# EAGLE design penny (EAGLE 7.1.0)
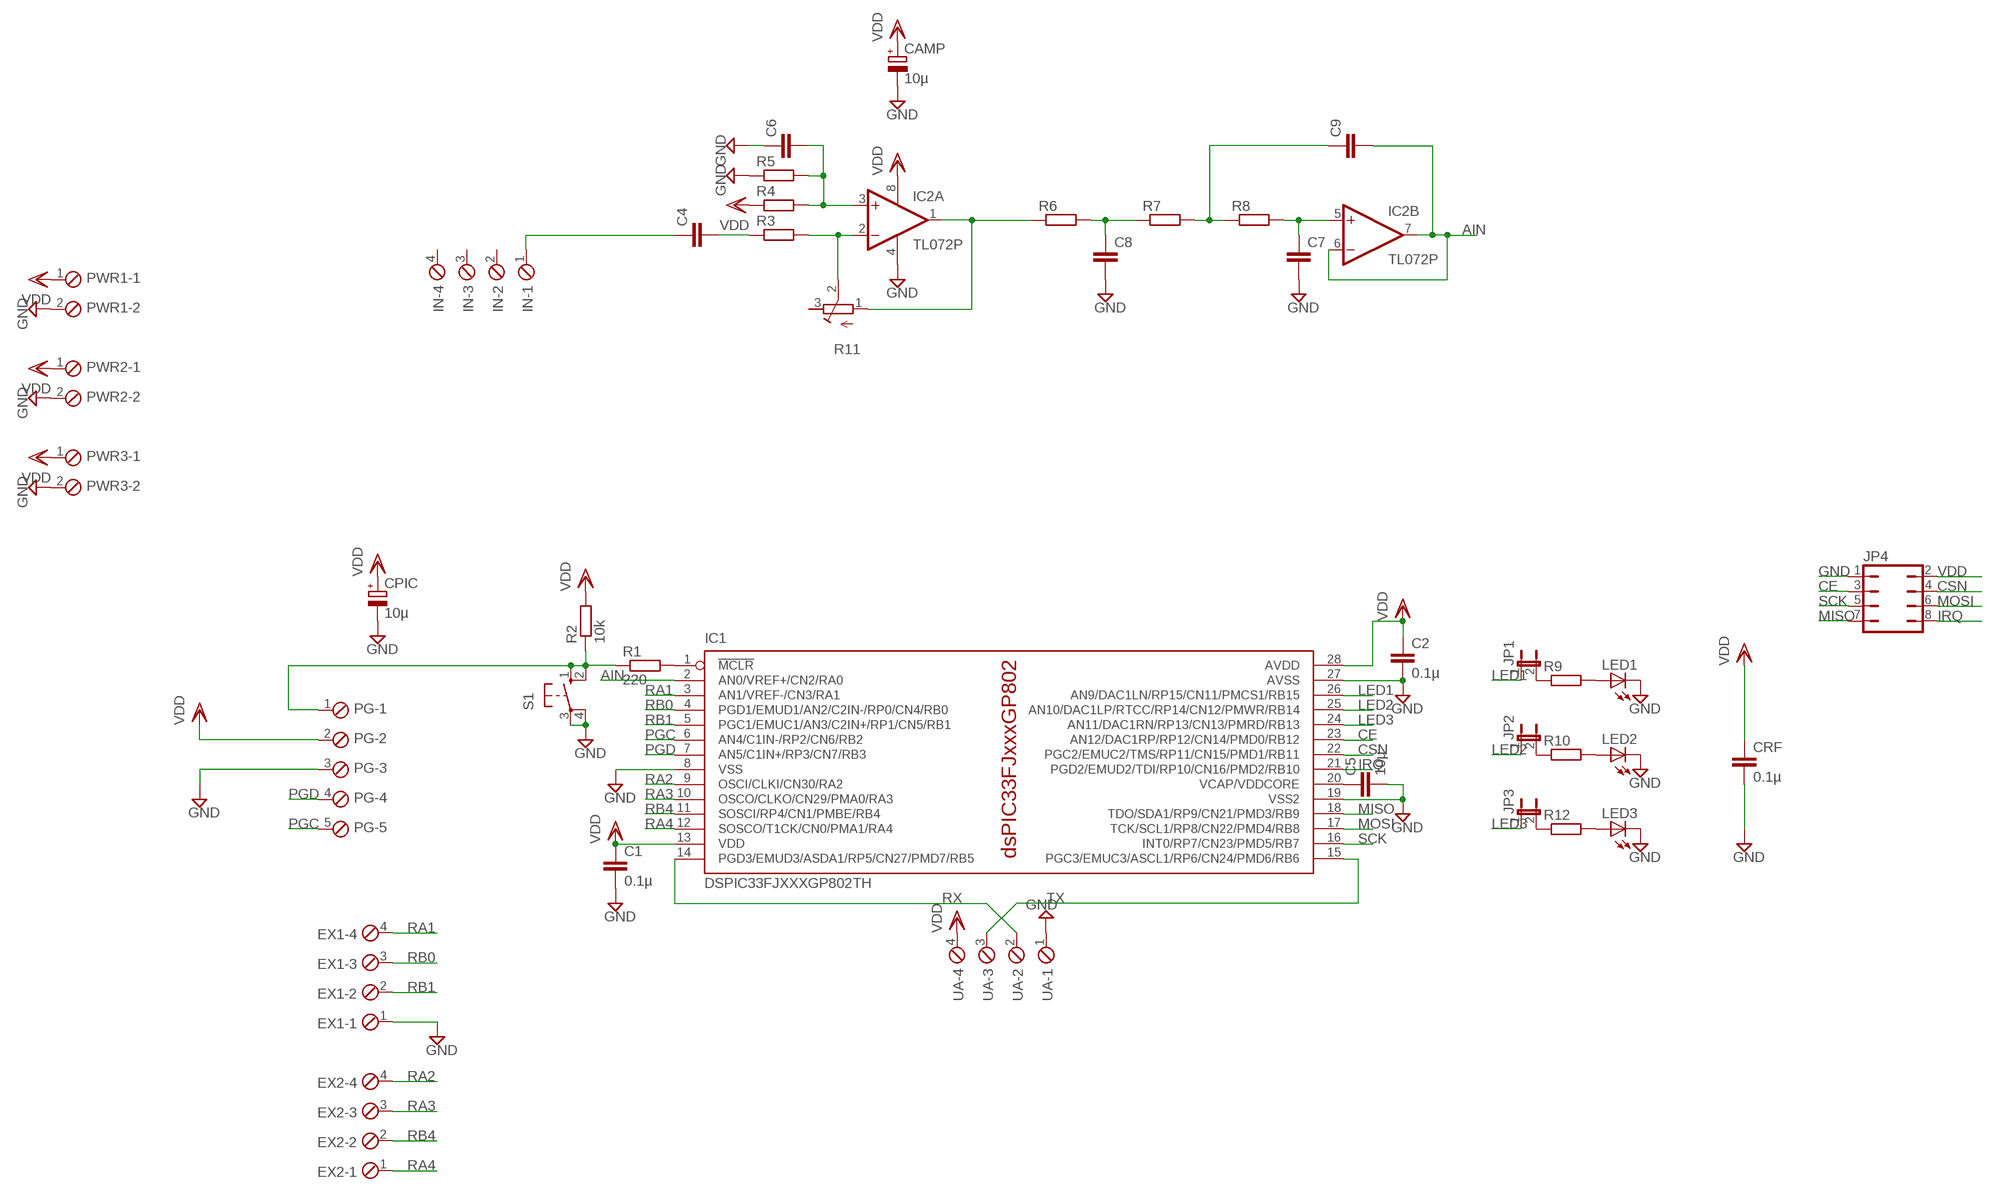
[diagram p0: schematic, sheet 1]

## Parts
C1  0.1µ  C-EU025-024X044  [C025-024X044]
C2  0.1µ  C-EU025-024X044  [C025-024X044]
C4  C-EU025-024X044  [C025-024X044]
C5  10µ  C-EU025-024X044  [C025-024X044]
C6  C-EU025-024X044  [C025-024X044]
C7  C-EU025-024X044  [C025-024X044]
C8  C-EU025-024X044  [C025-024X044]
C9  C-EU025-024X044  [C025-024X044]
CAMP  10µ  CPOL-EUE2.5-5  [E2,5-5]
CPIC  10µ  CPOL-EUE2.5-5  [E2,5-5]
CRF  0.1µ  C-EU025-024X044  [C025-024X044]
EX1  MPT4  [4POL254]
EX2  MPT4  [4POL254]
IC1  DSPIC33FJXXXGP802TH  [DIL28-3]
IC2  TL072P  [DIL08]
IN  MPT4  [4POL254]
JP1  JP1E  [JP1]
JP2  JP1E  [JP1]
JP3  JP1E  [JP1]
JP4  JP4Q  [JP4Q]
LED1  LED3MM  [LED3MM]
LED2  LED3MM  [LED3MM]
LED3  LED3MM  [LED3MM]
PG  MPT5  [5POL254]
PWR1  MPT2  [2POL254]
PWR2  MPT2  [2POL254]
PWR3  MPT2  [2POL254]
R1  220  R-EU_0207/10  [0207/10]
R2  10k  R-EU_0207/10  [0207/10]
R3  R-EU_0207/10  [0207/10]
R4  R-EU_0207/10  [0207/10]
R5  R-EU_0207/10  [0207/10]
R6  R-EU_0207/10  [0207/10]
R7  R-EU_0207/10  [0207/10]
R8  R-EU_0207/10  [0207/10]
R9  R-EU_0207/10  [0207/10]
R10  R-EU_0207/10  [0207/10]
R11  R-TRIMM3339P  [RTRIM3339P]
R12  R-EU_0207/10  [0207/10]
S1  10-XX  [B3F-10XX]
UA  MPT4  [4POL254]

## Nets
AIN: C9.2 IC1.2(AN0/VREF+/CN2/RA0) IC2.6(B:-IN) IC2.7(B:OUT)
CE: IC1.23(AN12/DAC1RP/RP12/CN14/PMD0/RB12) JP4.3
CSN: IC1.22(PGC2/EMUC2/TMS/RP11/CN15/PMD1/RB11) JP4.4
GND: C1.2 C2.2 C5.2 C6.1 C7.2 C8.2 CAMP.- CPIC.- CRF.2 EX1.1 IC1.8(VSS) IC1.19(VSS2) IC1.27(AVSS) IC2.4(P:V-) JP4.1 LED1.K(C) LED2.K(C) LED3.K(C) PG.3 PWR1.2 PWR2.2 PWR3.2 R5.1 S1.3(P) S1.4(P1) UA.1
IRQ: IC1.21(PGD2/EMUD2/TDI/RP10/CN16/PMD2/RB10) JP4.8
LED1: IC1.26(AN9/DAC1LN/RP15/CN11/PMCS1/RB15) JP1.1
LED2: IC1.25(AN10/DAC1LP/RTCC/RP14/CN12/PMWR/RB14) JP2.1
LED3: IC1.24(AN11/DAC1RN/RP13/CN13/PMRD/RB13) JP3.1
MISO: IC1.18(TDO/SDA1/RP9/CN21/PMD3/RB9) JP4.7
MOSI: IC1.17(TCK/SCL1/RP8/CN22/PMD4/RB8) JP4.6
N$1: IC1.1(!MCLR) R1.2
N$2: PG.1 R1.1 R2.1 S1.1(S) S1.2(S1)
N$3: C6.2 IC2.3(A:+IN) R4.2 R5.2
N$4: IC2.2(A:-IN) R3.2 R11.2(S)
N$5: C4.2 R3.1
N$6: IC2.1(A:OUT) R6.1 R11.1(A)
N$7: C4.1 IN.1
N$8: C8.1 R6.2 R7.1
N$9: C5.1 IC1.20(VCAP/VDDCORE)
N$10: C9.1 R7.2 R8.1
N$11: C7.1 IC2.5(B:+IN) R8.2
N$12: JP1.2 R9.1
N$13: LED1.A R9.2
N$14: JP2.2 R10.1
N$15: LED2.A R10.2
N$16: LED3.A R12.2
N$17: JP3.2 R12.1
PGC: IC1.6(AN4/C1IN-/RP2/CN6/RB2) PG.5
PGD: IC1.7(AN5/C1IN+/RP3/CN7/RB3) PG.4
RA1: EX1.4 IC1.3(AN1/VREF-/CN3/RA1)
RA2: EX2.4 IC1.9(OSCI/CLKI/CN30/RA2)
RA3: EX2.3 IC1.10(OSCO/CLKO/CN29/PMA0/RA3)
RA4: EX2.1 IC1.12(SOSCO/T1CK/CN0/PMA1/RA4)
RB0: EX1.3 IC1.4(PGD1/EMUD1/AN2/C2IN-/RP0/CN4/RB0)
RB1: EX1.2 IC1.5(PGC1/EMUC1/AN3/C2IN+/RP1/CN5/RB1)
RB4: EX2.2 IC1.11(SOSCI/RP4/CN1/PMBE/RB4)
RX: IC1.14(PGD3/EMUD3/ASDA1/RP5/CN27/PMD7/RB5) UA.2
SCK: IC1.16(INT0/RP7/CN23/PMD5/RB7) JP4.5
TX: IC1.15(PGC3/EMUC3/ASCL1/RP6/CN24/PMD6/RB6) UA.3
VDD: C1.1 C2.1 CAMP.+ CPIC.+ CRF.1 IC1.13(VDD) IC1.28(AVDD) IC2.8(P:V+) JP4.2 PG.2 PWR1.1 PWR2.1 PWR3.1 R2.2 R4.1 UA.4
Unconnected: IN.2 IN.3 IN.4 R11.3(E)

## Library data of the parts
C1 C2 C4-C9 CRF = rcl:C-EU: CAPACITOR, European symbol
CAMP CPIC = rcl:CPOL-EU: POLARIZED CAPACITOR, European symbol
EX1 EX2 IN UA = con-phoenix-254:MPT4: PHOENIX CONNECTOR; OC_FARNELL: unknown; OC_NEWARK: unknown
IC1 = microchip-dspic33:DSPIC33FJXXXGP802: High-Performance, 16-bit Digital Signal Controllers - dsPIC33FJ64GP802 & dsPIC33FJ128GP802 Source: http://ww1.microchip.com/downloads/en/DeviceDoc/70292B.pdf Operating Range: . Up to 40 MIPS operation (at 3.0-3.6V): - Industrial temperature range (-40°C to +85°C) - Extended temperature range (-40°C to +125°C) High-Performance DSC CPU: . Modified Harvard architecture . C compiler optimized instruction set . 16-bit wide data path . 24-bit wide instructions . Linear program memory addressing up to 4M instruction words . Linear data memory addressing up to 64 Kbytes . 83 base instructions: mostly 1 word/1 cycle . Two 40-bit accumulators with rounding and saturation options . Flexible and powerful addressing modes: - Indirect - Modulo - Bit-Reversed . Software stack . 16 x 16 fractional/integer multiply operations . 32/16 and 16/16 divide operations . Single-cycle multiply and accumulate: - Accumulator write back for DSP operations - Dual data fetch . Up to ±16-bit shifts for up to 40-bit data On-Chip Flash and SRAM: . Flash program memory . Data SRAM . Boot, Secure, and General Security for program Flash Direct Memory Access (DMA): . 8-channel hardware DMA . Up to 2 Kbytes dual ported DMA buffer area (DMA RAM) to store data transferred via DMA: - Allows data transfer between RAM and a peripheral while CPU is executing code (no cycle stealing) . Most peripherals support DMA Timers/Capture/Compare/PWM: . Timer/Counters, up to five 16-bit timers: - Can pair up to make two 32-bit timers - One timer runs as a Real-Time Clock with an external 32.768 kHz oscillator - Programmable prescaler . Input Capture (up to four channels): - Capture on up, down or both edges - 16-bit capture input functions - 4-deep FIFO on each capture . Output Compare (up to four channels): - Single or Dual 16-bit Compare mode - 16-bit Glitchless PWM mode . Hardware Real-Time Clock/Calendar (RTCC): - Provides clock, calendar, and alarm functions Interrupt Controller: . 5-cycle latency . 118 interrupt vectors . Up to 49 available interrupt sources . Up to three external interrupts . Seven programmable priority levels . Five processor exceptions Digital I/O: . Peripheral pin Select functionality . Up to 35 programmable digital I/O pins . Wake-up/Interrupt-on-Change for up to 21 pins . Output pins can drive from 3.0V to 3.6V . Up to 5V output with open drain configuration . All digital input pins are 5V tolerant . 4 mA sink on all I/O pins System Management: . Flexible clock options: - External, crystal, resonator, internal RC - Fully integrated Phase-Locked Loop (PLL) - Extremely low jitter PLL . Power-up Timer . Oscillator Start-up Timer/Stabilizer . Watchdog Timer with its own RC oscillator . Fail-Safe Clock Monitor . Reset by multiple sources Power Management: . On-chip 2.5V voltage regulator . Switch between clock sources in real time . Idle, Sleep, and Doze modes with fast wake-up Analog-to-Digital Converters (ADCs): . 10-bit, 1.1 Msps or 12-bit, 500 Ksps conversion: - Two and four simultaneous samples (10-bit ADC) - Up to 13 input channels with auto-scanning - Conversion start can be manual or synchronized with one of four trigger sources - Conversion possible in Sleep mode - ±2 LSb max integral nonlinearity - ±1 LSb max differential nonlinearity Audio Digital-to-Analog Converter (DAC): . 16-bit Dual Channel DAC module . 100 Ksps maximum sampling rate . Second-Order Digital Delta-Sigma Modulator Data Converter Interface (DCI) module: . Codec interface . Supports I2S and AC.97 protocols . Up to 16-bit data words, up to 16 words per frame . 4-word deep TX and RX buffers Comparator Module: . Two analog comparators with programmable input/output configuration CMOS Flash Technology: . Low-power, high-speed Flash technology . Fully static design . 3.3V (±10%) operating voltage . Industrial and Extended temperature . Low power consumption Communication Modules: . 4-wire SPI (up to two modules): - Framing supports I/O interface to simple codecs - Supports 8-bit and 16-bit data - Supports all serial clock formats and sampling modes . I2C?: - Full Multi-Master Slave mode support - 7-bit and 10-bit addressing - Bus collision detection and arbitration - Integrated signal conditioning - Slave address masking . UART (up to two modules): - Interrupt on address bit detect - Interrupt on UART error - Wake-up on Start bit from Sleep mode - 4-character TX and RX FIFO buffers - LIN bus support - IrDA® encoding and decoding in hardware - High-Speed Baud mode - Hardware Flow Control with CTS and RTS . Enhanced CAN (ECAN. module) 2.0B active: - Up to eight transmit and up to 32 receive buffers - 16 receive filters and three masks - Loopback, Listen Only and Listen All - Messages modes for diagnostics and bus monitoring - Wake-up on CAN message - Automatic processing of Remote Transmission Requests - FIFO mode using DMA - DeviceNet. addressing support . Parallel Master Slave Port (PMP/EPSP): - Supports 8-bit or 16-bit data - Supports 16 address lines . Programmable Cyclic Redundancy Check (CRC): - Programmable bit length for the CRC generator polynomial (up to 16-bit length) - 8-deep, 16-bit or 16-deep, 8-bit FIFO for data input
IC2 = linear:TL072: OP AMP
JP1-JP3 = jumper:JP1E: JUMPER
JP4 = jumper:JP4Q: JUMPER
LED1-LED3 = led:LED: LED OSRAM: - CHIPLED LG R971, LG N971, LY N971, LG Q971, LY Q971, LO R971, LY R971 LH N974, LH R974 LS Q976, LO Q976, LY Q976 LO Q996 - Hyper CHIPLED LW Q18S LB Q993, LB Q99A, LB R99A - SideLED LS A670, LO A670, LY A670, LG A670, LP A670 LB A673, LV A673, LT A673, LW A673 LH A674 LY A675 LS A676, LA A676, LO A676, LY A676, LW A676 LS A679, LY A679, LG A679 - Hyper Micro SIDELED® LS Y876, LA Y876, LO Y876, LY Y876 LT Y87S - SmartLED LW L88C, LW L88S LB L89C, LB L89S, LG L890 LS L89K, LO L89K, LY L89K LS L896, LA L896, LO L896, LY L896 - TOPLED LS T670, LO T670, LY T670, LG T670, LP T670 LSG T670, LSP T670, LSY T670, LOP T670, LYG T670 LG T671, LOG T671, LSG T671 LB T673, LV T673, LT T673, LW T673 LH T674 LS T676, LA T676, LO T676, LY T676, LB T676, LH T676, LSB T676, LW T676 LB T67C, LV T67C, LT T67C, LS T67K, LO T67K, LY T67K, LW E67C LS E67B, LA E67B, LO E67B, LY E67B, LB E67C, LV E67C, LT E67C LW T67C LS T679, LY T679, LG T679 LS T770, LO T770, LY T770, LG T770, LP T770 LB T773, LV T773, LT T773, LW T773 LH T774 LS E675, LA E675, LY E675, LS T675 LS T776, LA T776, LO T776, LY T776, LB T776 LHGB T686 LT T68C, LB T68C - Hyper Mini TOPLED® LB M676 - Mini TOPLED Santana® LG M470 LS M47K, LO M47K, LY M47K Source: http://www.osram.convergy.de LUXEON: - LUMILED® LXK2-PW12-R00, LXK2-PW12-S00, LXK2-PW14-U00, LXK2-PW14-V00 LXK2-PM12-R00, LXK2-PM12-S00, LXK2-PM14-U00 LXK2-PE12-Q00, LXK2-PE12-R00, LXK2-PE12-S00, LXK2-PE14-T00, LXK2-PE14-U00 LXK2-PB12-K00, LXK2-PB12-L00, LXK2-PB12-M00, LXK2-PB14-N00, LXK2-PB14-P00, LXK2-PB14-Q00 LXK2-PR12-L00, LXK2-PR12-M00, LXK2-PR14-Q00, LXK2-PR14-R00 LXK2-PD12-Q00, LXK2-PD12-R00, LXK2-PD12-S00 LXK2-PH12-R00, LXK2-PH12-S00 LXK2-PL12-P00, LXK2-PL12-Q00, LXK2-PL12-R00 Source: www.luxeon.com KINGBRIGHT: KA-3528ASYC Source: www.kingbright.com
PG = con-phoenix-254:MPT5: PHOENIX CONNECTOR; OC_FARNELL: unknown; OC_NEWARK: unknown
PWR1-PWR3 = con-phoenix-254:MPT2: PHOENIX CONNECTOR; OC_FARNELL: unknown; OC_NEWARK: unknown
R1-R10 R12 = rcl:R-EU_: RESISTOR, European symbol
R11 = rcl:R-TRIMM: Trimm resistor
S1 = switch-omron:10-XX: OMRON SWITCH; MPN: B3F-1000; OC_FARNELL: 176432; OC_NEWARK: 36M3542

## Board
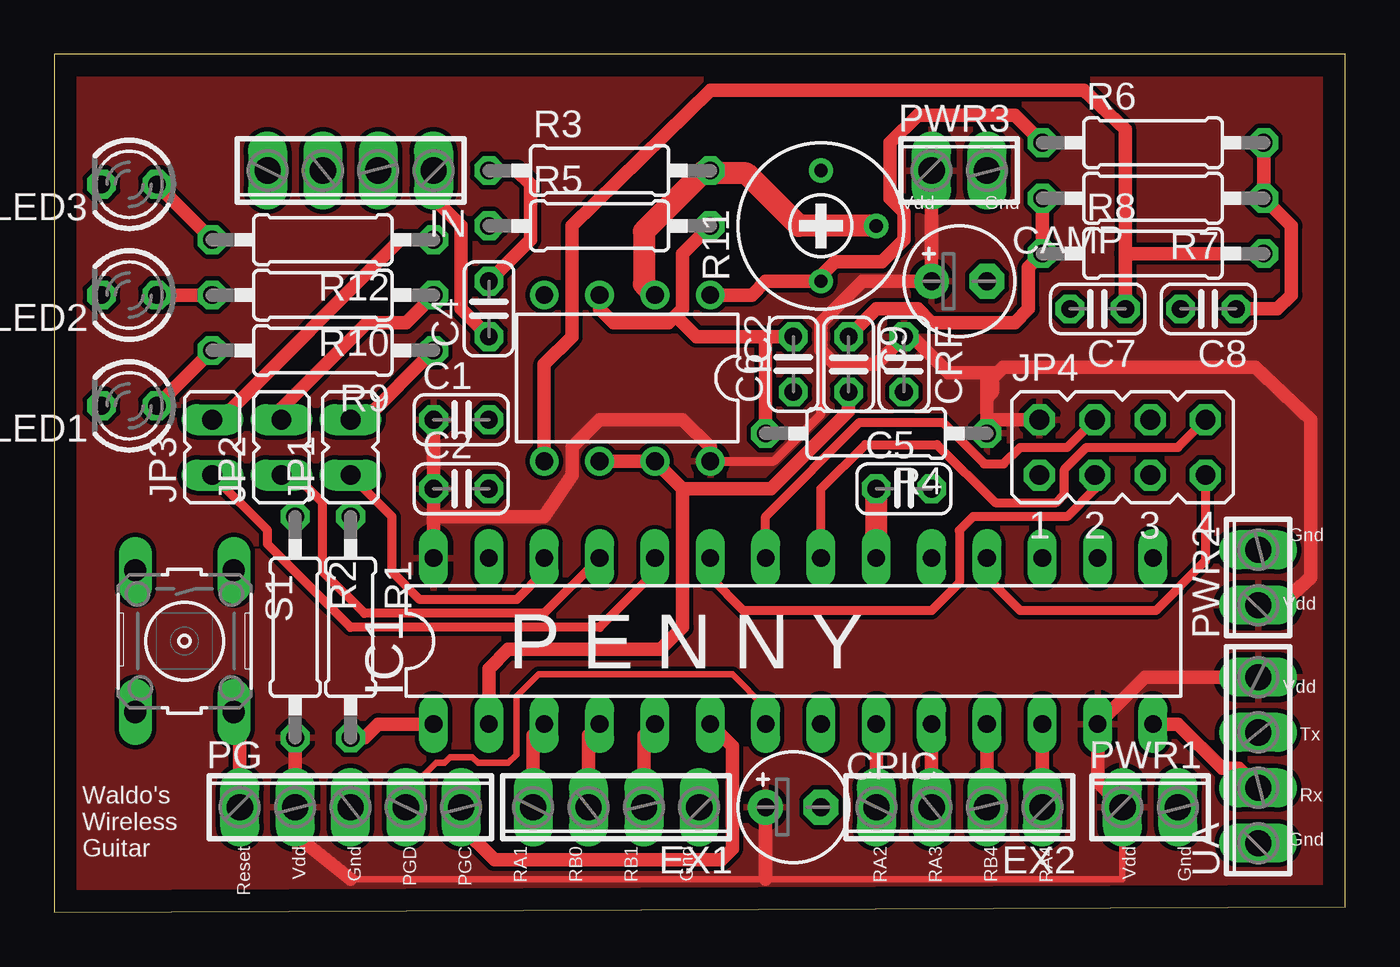
[diagram p1: board, top side]
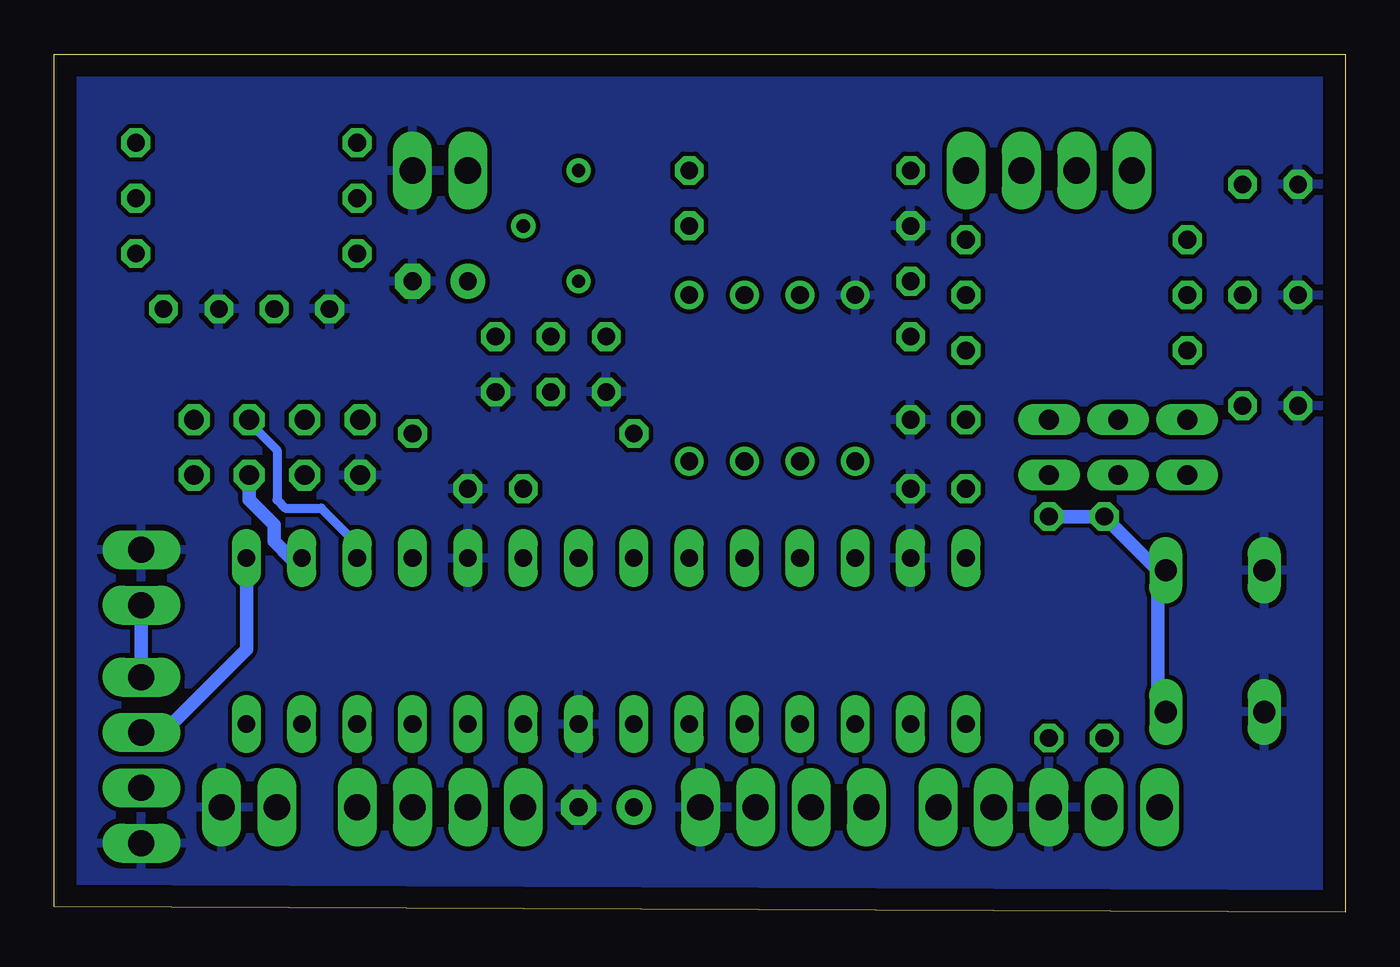
[diagram p2: board, bottom side, seen from below]

Size 59.23 x 39.36 mm. Coordinates in mm from the lower left corner, seen from the top.
Outline: 0,0 59.23,0.25 59.23,39.36 0,39.36 0,0
Copper layers (1*16): Top 0.035mm / dielectric 1.5mm / Bottom 0.035mm
Design rules "default": minimum track width 10mil, minimum drill 24mil, track to track 8mil, track to pad 8mil, pad to pad 8mil, via to via 8mil, smd to smd 8mil, copper to edge 40mil, drill to drill 8mil, minimum pad ring 10mil, minimum via ring 8mil, stop-mask expansion 4mil, vias tented up to drill 0mil, thermal gap 10mil

### Footprints (pad centres in the part's own frame; a part is rotated, then mirrored left to right if it is on the bottom)
C025-024X044 = drill 0.813 octagon: 1 -1.27,0; 2 1.27,0
E2,5-5 = drill 0.813 pad 1.6: + -1.27,0 | drill 0.813 pad 1.6 octagon: - 1.27,0
4POL254 = drill 1.2 long: 1 -3.81,0; 2 -1.27,0; 3 1.27,0; 4 3.81,0
DIL28-3 = drill 0.813 long: 1 -16.51,-3.81; 2 -13.97,-3.81; 3 -11.43,-3.81; 4 -8.89,-3.81; 5 -6.35,-3.81; 6 -3.81,-3.81; 7 -1.27,-3.81; 8 1.27,-3.81; 9 3.81,-3.81; 10 6.35,-3.81; 11 8.89,-3.81; 12 11.43,-3.81; 13 13.97,-3.81; 14 16.51,-3.81; 15 16.51,3.81; 16 13.97,3.81; 17 11.43,3.81; 18 8.89,3.81; 19 6.35,3.81; 20 3.81,3.81; 21 1.27,3.81; 22 -1.27,3.81; 23 -3.81,3.81; 24 -6.35,3.81; 25 -8.89,3.81; 26 -11.43,3.81; 27 -13.97,3.81; 28 -16.51,3.81
DIL08 = drill 0.813 pad 1.27: 1 -3.81,-3.81; 2 -1.27,-3.81; 3 1.27,-3.81; 4 3.81,-3.81; 5 3.81,3.81; 6 1.27,3.81; 7 -1.27,3.81; 8 -3.81,3.81
JP1 = drill 0.914 long: 1 0,-1.27; 2 0,1.27
JP4Q = drill 0.914 octagon: 1 -3.81,-1.27; 2 -3.81,1.27; 3 -1.27,-1.27; 4 -1.27,1.27; 5 1.27,-1.27; 6 1.27,1.27; 7 3.81,-1.27; 8 3.81,1.27
LED3MM = drill 0.813 octagon: A -1.27,0; K 1.27,0
5POL254 = drill 1.2 long: 1 -5.08,0; 2 -2.54,0; 3 0,0; 4 2.54,0; 5 5.08,0
2POL254 = drill 1.2 long: 1 -1.27,0; 2 1.27,0
0207/10 = drill 0.813 octagon: 1 -5.08,0; 2 5.08,0
RTRIM3339P = drill 0.61: 1 -2.54,0; 2 0,-2.54; 3 2.54,0
B3F-10XX = drill 1.016 long: 1 -3.251,2.261; 2 3.251,2.261; 3 -3.251,-2.261; 4 3.251,-2.261

### Placement (x,y rotation side)
C1  18.67,22.61 0 top
C2  18.67,19.43 0 top
C4  19.94,27.69 90 top
C5  38.99,19.43 0 top
C6  33.91,25.15 90 top
C7  47.88,27.69 180 top
C8  52.96,27.69 180 top
C9  36.45,25.15 270 top
CAMP  41.53,28.96 0 top
CPIC  33.91,4.83 0 top
CRF  38.99,25.15 270 top
EX1  25.78,4.83 180 top
EX2  41.53,4.83 180 top
IC1  33.91,12.45 0 top
IC2  26.29,24.51 180 top
IN  13.59,34.04 180 top
JP1  13.59,21.34 0 top
JP2  10.41,21.34 0 top
JP3  7.24,21.34 0 top
JP4  49.02,21.34 0 top
LED1  3.43,23.24 180 top
LED2  3.43,28.32 180 top
LED3  3.43,33.4 180 top
PG  13.59,4.83 0 top
PWR1  50.29,4.83 0 top
PWR2  55.24,15.37 90 top
PWR3  41.53,34.04 0 top
R1  13.59,13.08 270 top
R2  11.05,13.08 270 top
R3  25.02,34.04 0 top
R4  37.72,21.97 180 top
R5  25.02,31.5 0 top
R6  50.42,35.31 0 top
R7  50.42,32.77 180 top
R8  50.42,30.23 0 top
R9  12.32,25.78 180 top
R10  12.32,28.32 180 top
R11  35.18,31.5 90 top
R12  12.32,30.86 180 top
S1  5.97,12.45 270 top
UA  55.24,6.99 90 top

### Tracks (layer width: path | path; a pad name or v marks a point on that pad's centre or on a via)
AIN
  Top 0.61: IC2.6 IC2.7 28.83,19.43 | 28.83,19.43 28.83,13.08 27.81,12.07 20.83,12.07 19.94,11.18 IC1.2 | 28.83,19.43 32.89,19.43 36.45,22.99 C9.2
CE
  Top 0.406: JP4.3 47.75,19.43 46.48,18.16 42.16,18.16 41.53,17.53 41.53,15.11 40.26,13.84 31.62,13.84 30.1,15.37 IC1.23
CSN
  Top 0.406: JP4.4 46.48,21.34 44.32,21.34 43.56,20.57 42.67,20.57 40.77,22.48 36.96,22.48 32.64,18.16 IC1.22
GND
  pour Bottom: 1.02,39.12 58.93,39.12 58.93,0.76 0.89,0.51
IRQ
  Top 0.406: IC1.21 35.18,19.43 37.21,21.46 40.51,21.46 43.18,18.8 45.97,18.8 46.36,19.18 46.36,20.32 47.37,21.34 51.56,21.34 JP4.8
LED1
  Top 0.406: IC1.26 22.48,15.62 21.21,14.35 16.76,14.35 15.49,15.62 15.49,18.16 JP1.1
LED2
  Top 0.406: IC1.25 22.48,13.72 14.22,13.72 12.32,15.62 12.32,18.8 11.05,20.07 JP2.1
LED3
  Top 0.406: IC1.24 27.56,15.62 25.02,13.08 13.59,13.08 9.78,16.89 9.78,17.53 JP3.1
MISO
  Top 0.406: JP4.7 52.83,16.13 50.55,13.84 44.32,13.84 42.8,15.37 IC1.18
MOSI
  Bottom 0.406: JP4.6 50.29,22.48 49.02,21.21 49.02,18.92 48.64,18.54 46.99,18.54 45.34,16.89 IC1.17
N$1
  Top 0.61: R1.2 14.22,8 14.86,8.64 IC1.1
N$2
  Top 0.61: PG.1 8.51,8.91 S1.2
  Bottom 0.61: S1.1 8.59,15.7 | 8.59,15.7 R2.1 R1.1 | 8.59,15.7 8.59,9.55 S1.2
N$3
  Top 0.61: IC2.3 25.02,27.69 25.65,27.05 28.19,27.05 28.51,27.37 | 28.51,27.37 28.83,27.69 28.83,30.23 R5.2 | C6.2 32.64,26.42 | 32.64,26.42 29.46,26.42 28.51,27.37 | R4.2 32.64,26.42
N$4
  Top 1.016: IC2.2 27.05,28.83 27.05,31.24 29.84,34.04 R3.2 30.23,33.91 31.75,33.91 34.16,31.5 R11.2
N$5
  Top 0.61: C4.2 21.84,30.86 21.84,33.4 21.21,34.04 R3.1
N$6
  Top 0.61: R6.1 44.07,36.58 39.62,36.58 38.35,35.31 38.35,32.77 38.99,32.13 38.99,30.86 37.97,29.84 35.81,29.84 35.18,29.21 R11.1 32.64,28.96 32,28.32 IC2.1
N$7
  Top 0.61: IN.1 17.4,32.77 18.67,31.5 18.67,27.69 C4.1
N$8
  Top 0.61: R6.2 R7.1 56.77,31.5 56.77,28.32 56.13,27.69 C8.1
N$9
  Top 1.016: IC1.20 C5.1
N$10
  Top 0.61: R7.2 R8.1 44.7,29.59 44.7,27.69 44.07,27.05 40.26,27.05 39.62,27.69 37.72,27.69 C9.1
N$11
  Top 0.61: IC2.5 22.48,25.15 23.75,26.42 23.75,31.5 30.1,37.72 47.24,37.72 49.15,35.94 49.15,30.23 | 49.15,30.23 C7.1 | R8.2 49.15,30.23
N$12
  Top 0.61: JP1.2 14.22,22.61 R9.1
N$13
  Top 0.61: R9.2 LED1.A
N$14
  Top 0.61: JP2.2 10.41,23.11 14.35,27.05 16.13,27.05 R10.1
N$15
  Top 0.61: R10.2 LED2.A
N$16
  Top 0.61: R12.2 LED3.A
N$17
  Top 0.61: JP3.2 7.62,22.61 15.88,30.86 R12.1
PGC
  Top 0.61: PG.5 18.67,3.94 20.19,2.41 30.61,2.41 31.12,2.92 31.12,7.62 IC1.6
PGD
  Top 0.305: 16.13,5.33 16.13,5.46 17.53,6.86 17.91,6.86 18.16,7.11 19.18,7.11 19.43,6.86 20.83,6.86 21.21,7.24 21.21,9.91 22.23,10.92 31.12,10.92 32.64,9.4 IC1.7
  Top 0.61: PG.4 16.13,5.33
RA1
  Top 0.61: EX1.4 21.97,8.13 IC1.3
RA2
  Top 0.61: EX2.4 IC1.9
RA3
  Top 0.61: EX2.3 IC1.10
RA4
  Top 0.61: EX2.1 IC1.12
RB0
  Top 0.61: EX1.3 24.51,8.13 IC1.4
RB1
  Top 0.61: EX1.2 27.05,8.13 IC1.5
RB4
  Top 0.61: EX2.2 IC1.11
RX
  Top 0.61: IC1.14 51.56,8.64 53.59,6.6 54.36,6.6 UA.2
SCK
  Bottom 0.61: IC1.16 48.39,16.26 49.15,17.02 49.15,17.78 50.29,18.92 JP4.5
TX
  Bottom 0.61: IC1.15 50.42,12.07 54.23,8.25 UA.3
VDD
  Top 0.305: 13.59,1.52 32.64,1.52 49.02,1.52 PWR1.1
  Top 0.406: PG.2 R2.2 | IC2.8 33.02,20.7 35.18,22.86 35.18,25.78
  Top 0.61: PWR3.1 CAMP.+ 37.08,28.96 35.18,27.05 35.18,25.78 35.81,25.15 37.72,25.15 CRF.1 39.37,26.42 41.02,24.77 43.31,24.77 | R4.1 42.8,22.61 | 42.8,22.61 42.8,23.62 | 42.8,23.62 42.8,24.51 | IC1.28 17.4,18.16 | 17.4,18.16 C2.1 C1.1 | IC2.8 30.1,21.34 28.83,22.61 25.02,22.61 23.75,21.34 23.75,20.07 22.48,18.16 17.4,18.16 | R2.2 11.05,3.56 13.59,1.52 | 32.64,1.52 CPIC.+ | 42.8,23.62 43.05,23.88 43.05,24.51 43.31,24.77 | PWR1.1 47.88,5.97 IC1.13 50.04,10.8 UA.4 | 43.31,24.77 43.56,25.02 55.12,25.02 57.66,22.61 57.66,15.37 56.26,14.1 PWR2.1 | JP4.2 42.8,22.61
  Bottom 0.61: UA.4 PWR2.1
  pour Top: 0.13,39.12 58.93,39.12 58.93,0.51 0.13,0.51

### Text on the board
tNames: Vdd | Gnd | Gnd | Vdd | P E N N Y | Vdd | Tx | Rx | Reset | Vdd | Gnd | PGD | PGC | RA1 | RB0 | RB1 | Gnd | RA2 | RA3 | RB4 | RA4 | Vdd | Gnd | Gnd | Waldo's / Wireless / Guitar
Document: RE